# Altium schematic sheet obc-v2_TREE.SchDoc
size 420 x 297 mm; SheetNumber: 3; SheetTotal: 23
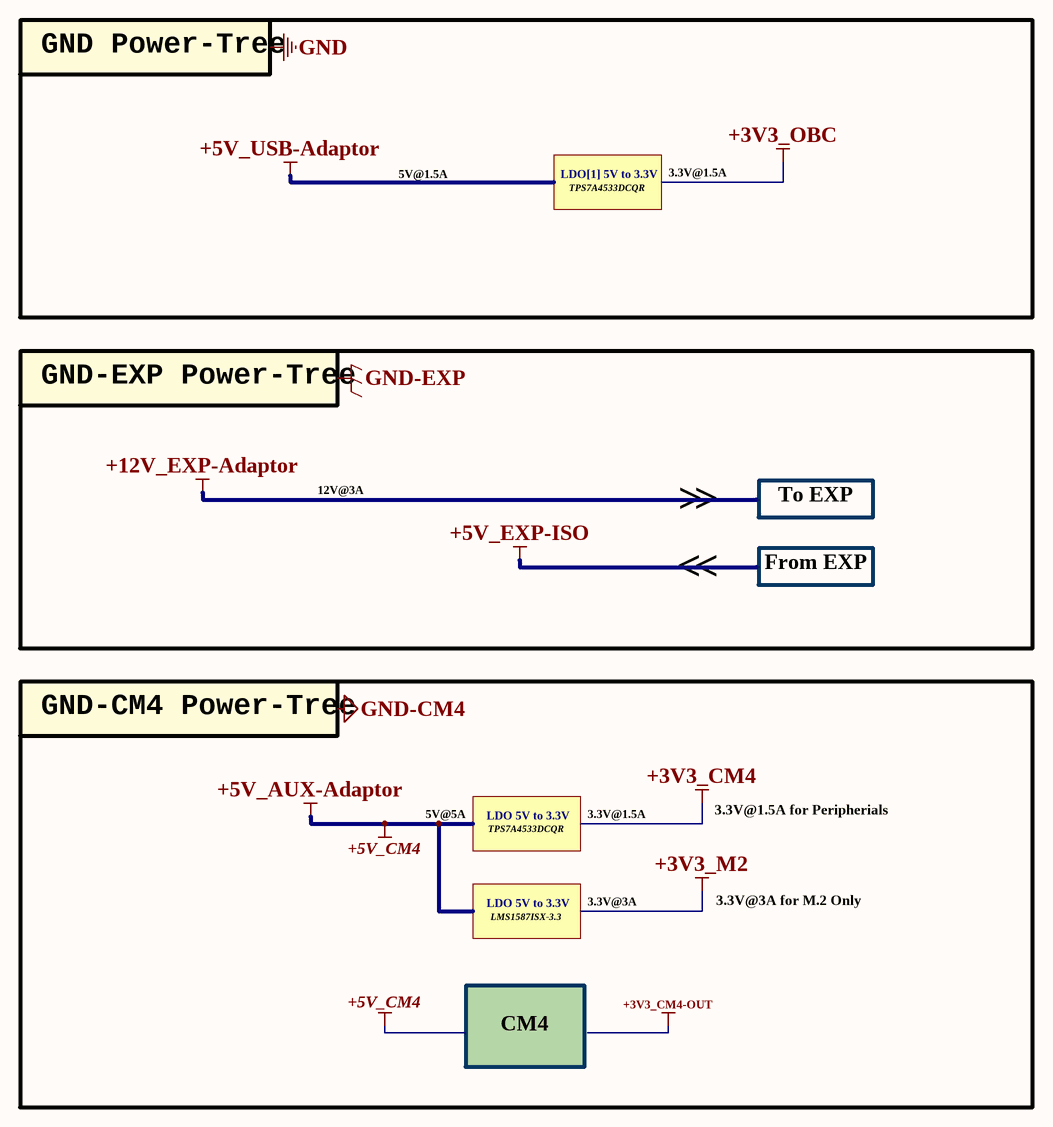
[diagram p0: obc-v2_TREE.SchDoc]

## Notes on the sheet
- GND Power-Tree
- 5V@1.5A
- LDO[1] 5V to 3.3V
- TPS7A4533DCQR
- 3.3V@1.5A
- GND-EXP Power-Tree
- 12V@3A
- >
- To EXP
- <
- From EXP
- GND-CM4 Power-Tree
- 5V@5A
- 3.3V@1.5A for Peripherials
- LDO 5V to 3.3V
- LMS1587ISX-3.3
- 3.3V@3A
- 3.3V@3A for M.2 Only
- CM4
- Labels drawn without touching a wire or pin: GND, GND-CM4, GND-EXP
- Project:
- Sub-system:
- Design by:
- Sheet title:
- Sheet
- A3
- of
- Checked by:
- Approved by:
- Revision:
- Document No:
- Size:
- Date: